# EAGLE schematic RiadenieMotorovL293D (EAGLE 6.4)
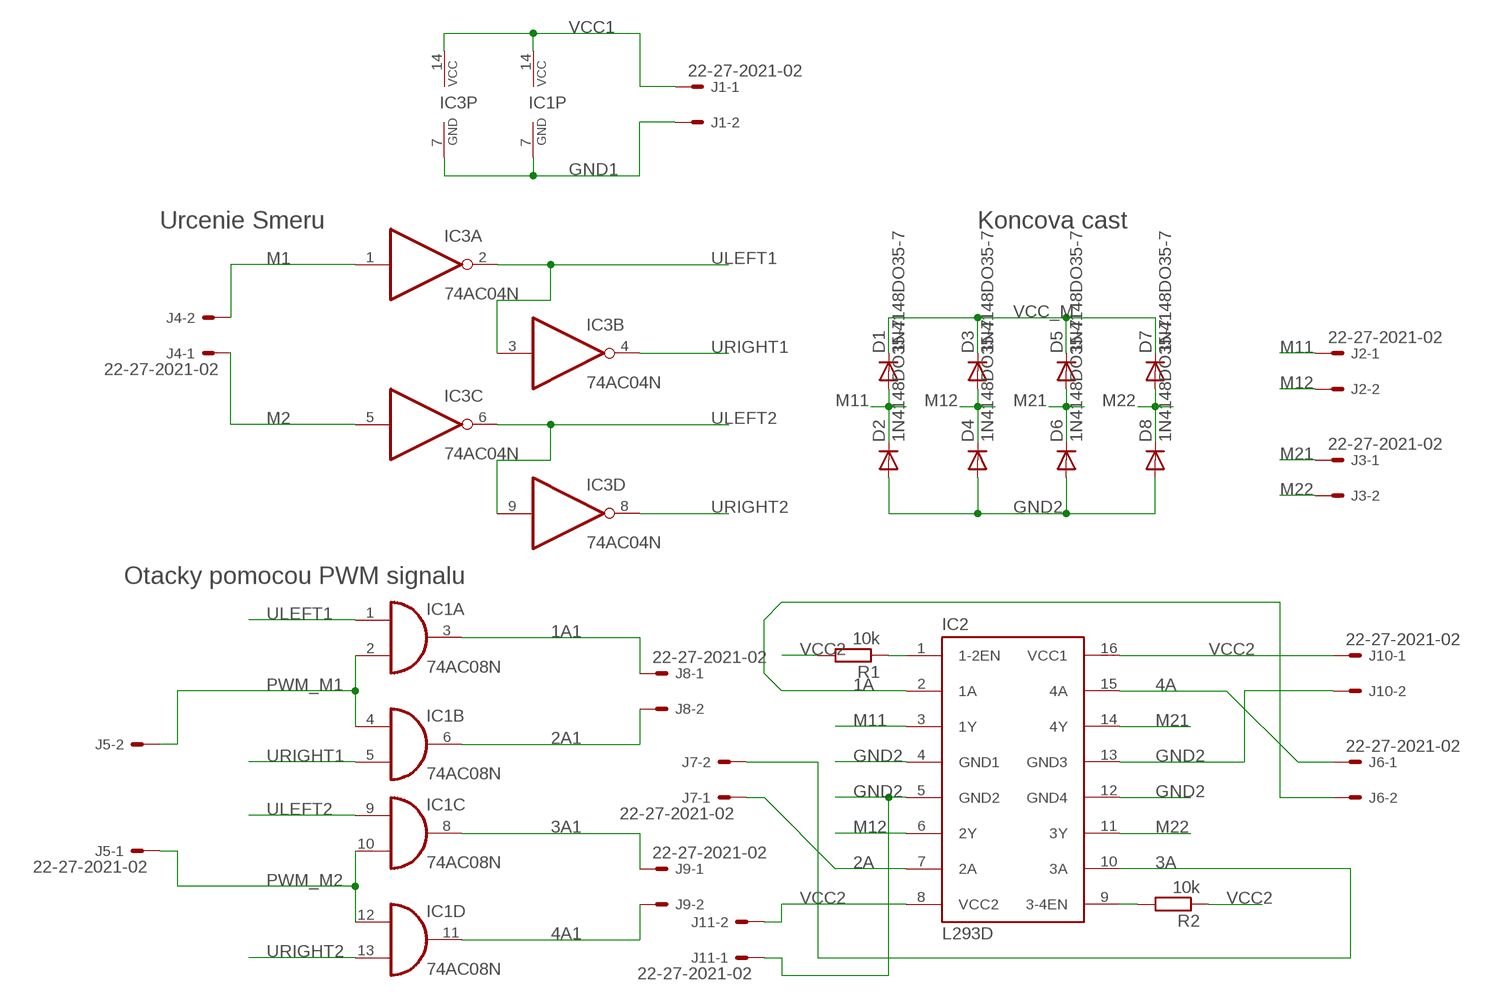
[diagram p0: schematic, sheet 1]

## Parts
D1  1N4148DO35-7  [DO35-7]
D2  1N4148DO35-7  [DO35-7]
D3  1N4148DO35-7  [DO35-7]
D4  1N4148DO35-7  [DO35-7]
D5  1N4148DO35-7  [DO35-7]
D6  1N4148DO35-7  [DO35-7]
D7  1N4148DO35-7  [DO35-7]
D8  1N4148DO35-7  [DO35-7]
IC1  74AC08N  [DIL14]
IC2  L293D  [DIL16]
IC3  74AC04N  [DIL14]
J1  22-27-2021-02  [6410-02]
J2  22-27-2021-02  [6410-02]
J3  22-27-2021-02  [6410-02]
J4  22-27-2021-02  [6410-02]
J5  22-27-2021-02  [6410-02]
J6  22-27-2021-02  [6410-02]
J7  22-27-2021-02  [6410-02]
J8  22-27-2021-02  [6410-02]
J9  22-27-2021-02  [6410-02]
J10  22-27-2021-02  [6410-02]
J11  22-27-2021-02  [6410-02]
R1  10k  R-EU_0207/10  [0207/10]
R2  10k  R-EU_0207/10  [0207/10]

## Nets
1A: IC2.2(1A) J6.2
1A1: IC1.3(A:O) J8.1
2A: IC2.7(2A) J7.1
2A1: IC1.6(B:O) J8.2
3A: IC2.10(3A) J7.2
3A1: IC1.8(C:O) J9.1
4A: IC2.15(4A) J6.1
4A1: IC1.11(D:O) J9.2
GND1: IC1.7(P:GND) IC3.7(P:GND) J1.2
GND2: D2.A D4.A D6.A D8.A IC2.4(GND1) IC2.5(GND2) IC2.12(GND4) IC2.13(GND3) J10.2 J11.1
M1: IC3.1(A:I) J4.2
M2: IC3.5(C:I) J4.1
M11: D1.A D2.C IC2.3(1Y) J2.1
M12: D3.A D4.C IC2.6(2Y) J2.2
M21: D5.A D6.C IC2.14(4Y) J3.1
M22: D7.A D8.C IC2.11(3Y) J3.2
N$1: IC2.1(1-2EN) R1.1
N$2: IC2.9(3-4EN) R2.2
PWM_M1: IC1.2(A:I1) IC1.4(B:I0) J5.2
PWM_M2: IC1.10(C:I1) IC1.12(D:I0) J5.1
ULEFT1: IC1.1(A:I0) IC3.2(A:O) IC3.3(B:I)
ULEFT2: IC1.9(C:I0) IC3.6(C:O) IC3.9(D:I)
URIGHT1: IC1.5(B:I1) IC3.4(B:O)
URIGHT2: IC1.13(D:I1) IC3.8(D:O)
VCC1: IC1.14(P:VCC) IC3.14(P:VCC) J1.1
VCC2: IC2.8(VCC2) IC2.16(VCC1) J10.1 J11.2 R1.2 R2.1
VCC_M: D1.C D3.C D5.C D7.C
Unconnected: IC3.10(E:O) IC3.11(E:I) IC3.12(F:O) IC3.13(F:I)

## Notes on the sheet
- Urcenie Smeru | Koncova cast
- Otacky pomocou PWM signalu

## Library data of the parts
D1-D8 = diode:1N4148: DIODE high speed (Philips)
IC1 = 74xx-eu:74*08: Quad 2-input AND gate
IC2 = st-microelectronics:L293D: PUSH-PULL 4 CHANNEL DRIVER; MPN: L293D; OC_FARNELL: 9589619; OC_NEWARK: 56P8249
IC3 = 74xx-eu:74*04: Hex INVERTER
J1-J11 = con-molex:22-?-02: CONNECTOR wire to board 2.54 mm (.1 inch) pitch header; OC_FARNELL: unknown; OC_NEWARK: unknown
R1 R2 = resistor:R-EU_: RESISTOR, European symbol